# Altium schematic sheet Output.SchDoc: Outputs
size A4; Engineer: CT; SheetNumber: 4; SheetTotal: 5
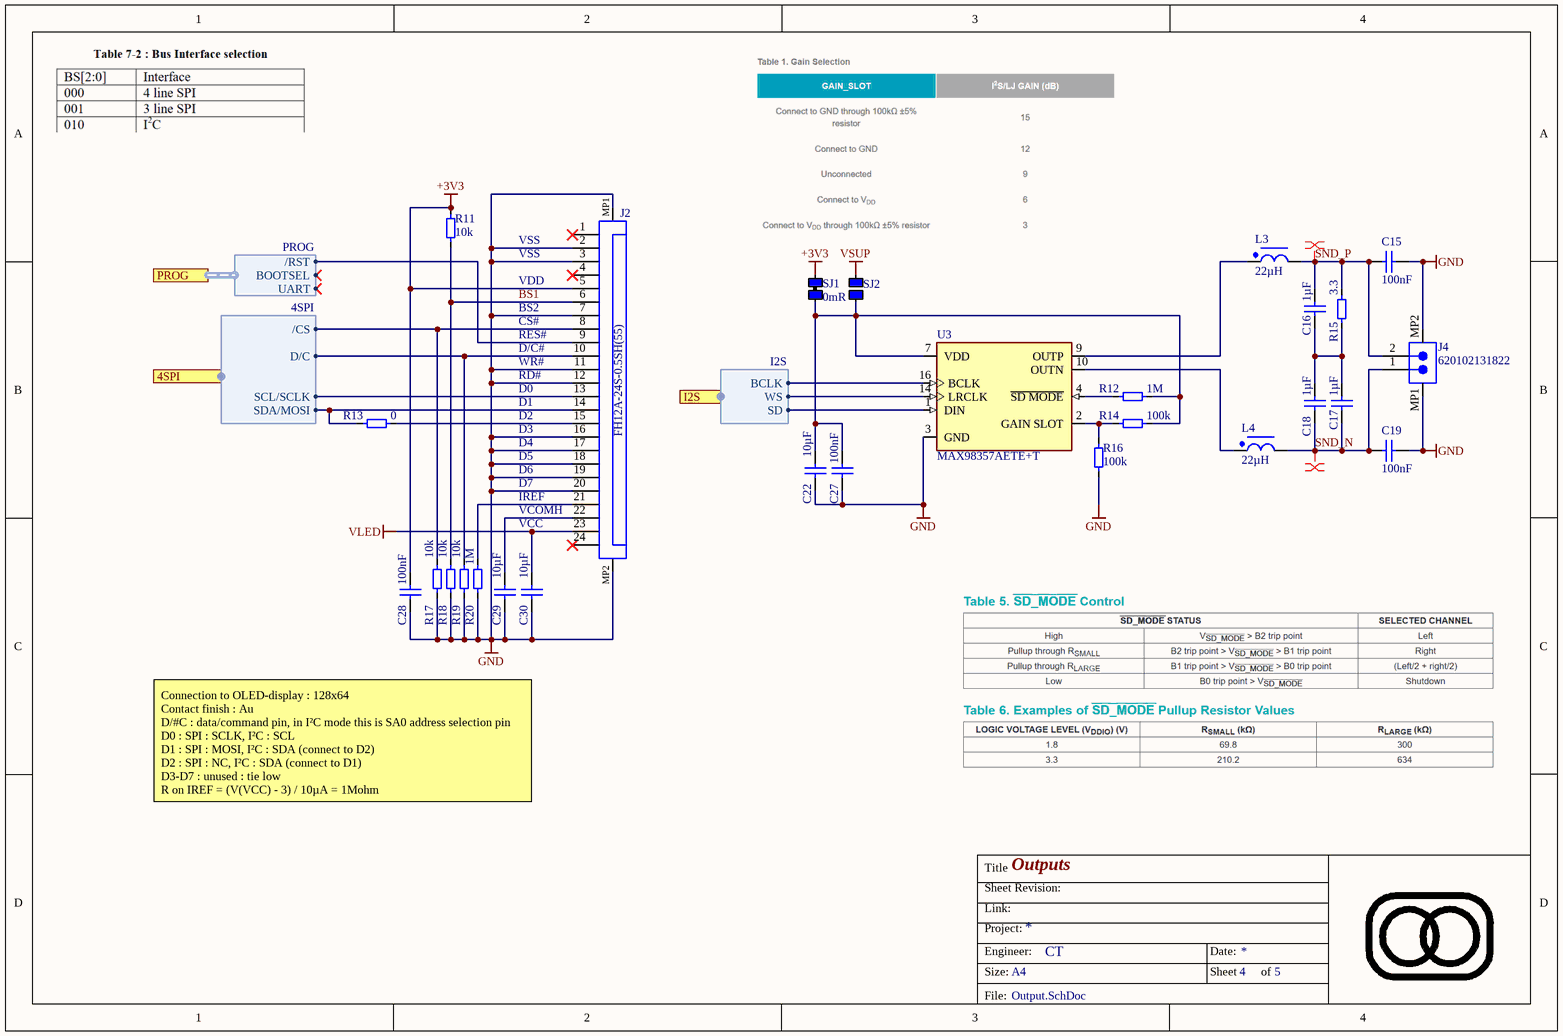
[diagram p0: Output.SchDoc]

## Parts
C15  value 100nF  [0603-C-N]  (hidden comment: Capacitor 100nF +/-10% 50V X7R 0603)
C16  value 1µF  [0805-C-N]  (hidden comment: Capacitor 1µF +/-10% 10V X7R 0805)
C17  value 1µF  [0805-C-N]  (hidden comment: Capacitor 1µF +/-10% 10V X7R 0805)
C18  value 1µF  [0805-C-N]  (hidden comment: Capacitor 1µF +/-10% 10V X7R 0805)
C19  value 100nF  [0603-C-N]  (hidden comment: Capacitor 100nF +/-10% 50V X7R 0603)
C22  value 10µF  [1206-C-N]  (hidden comment: Capacitor 10µF +/-10% 10V X7R 1206)
C27  value 100nF  [0603-C-N]  (hidden comment: Capacitor 100nF +/-10% 50V X7R 0603)
C28  value 100nF  [0603-C-N]  (hidden comment: Capacitor 100nF +/-10% 50V X7R 0603)
C29  value 10µF  [WCAP-CSGP_1210_L3.2W2.5H2.5]  (hidden comment: Capacitor 10µF +/-10% 50V X7R 1210)
C30  value 10µF  [1206-C-N]  (hidden comment: Capacitor 10µF +/-10% 10V X7R 1206)
J2  FH12A-24S-0.5SH(55)  [CF20241U0R0-NH]
J4  620102131822  [620102131822]
L3  Inductance: 22µH  [WE-LQS_6028]  (hidden comment: 74404063220)
L4  Inductance: 22µH  [WE-LQS_6028]  (hidden comment: 74404063220)
R11  value 10k  [0603-R-N]  (hidden comment: Resistor 10k +/-1% 50V 0603)
R12  value 1M  [0603-R-N]  (hidden comment: Resistor 1M +/-1% 50V 0603)
R13  value 0  [0603-R-N]  (hidden comment: Jumper 0R <50 mOhm 1A 0603)
R14  value 100k  [0603-R-N]  (hidden comment: Resistor 100k +/-1% 50V 0603)
R15  value 3.3  [1206-R-N]  (hidden comment: Resistor 3.3ohm 1% 0.25W 1206)
R16  value 100k  [0603-R-N]  (hidden comment: Resistor 100k +/-1% 50V 0603)
R17  value 10k  [0603-R-N]  (hidden comment: Resistor 10k +/-1% 50V 0603)
R18  value 10k  [0603-R-N]  (hidden comment: Resistor 10k +/-1% 50V 0603)
R19  value 10k  [0603-R-N]  (hidden comment: Resistor 10k +/-1% 50V 0603)
R20  value 1M  [0603-R-N]  (hidden comment: Resistor 1M +/-1% 50V 0603)
SJ1  value 0mR  [SJ_0603_1A]  (hidden comment: SJ-0603-1A)  (net tie, no BOM)
SJ2  Solder jumper open 1A  [Solder jumper open 1A-Footprint-1]  (value not drawn)  (no BOM)
U3  MAX98357AETE+T  [TQFN16-MFG]

## Ports
4SPI (harness 4SPI), I2S (harness I2S), PROG (harness PROG)

## Harnesses
4SPI: SDA/MOSI, SCL/SCLK, /CS, D/C
PROG: /RST, UART, BOOTSEL
I2S: BCLK, WS, SD

## Nets
+3V3: C28.1 J2.5 R11.2 SJ1.2(R)
GND: C15.2 C19.2 C22.1 C27.1 C28.2 C29.1 C30.1 J2.2 J2.3 J2.7 J2.11 J2.12 J2.16 J2.17 J2.18 J2.19 J2.20 J2.MP1 J2.MP2 J4.MP1 J4.MP2 R16.1 R17.1 R18.1 R19.1 R20.1 U3.3(GND)
VLED: C30.2 J2.23
VSUP: SJ2.2(R)
BS1: J2.6 R11.1 R18.2
SND_N: C17.1 C18.1 C19.1 J4.1 L4.2
SND_P: C15.1 C16.2 J4.2 L3.2 R15.2
NetC16_1: C16.1 C17.2 C18.2 R15.1
NetC22_2: C22.2 C27.2 R12.1 R14.2 SJ1.1(L) SJ2.1(L) U3.7(VDD)
NetC29_2: C29.2 J2.22
NetJ2_8: J2.8 R17.2 ; port 4SPI./CS
NetJ2_9: J2.9 ; port PROG./RST
NetJ2_10: J2.10 R19.2 ; port 4SPI.D/C
NetJ2_13: J2.13 ; port 4SPI.SCL/SCLK
NetJ2_14: J2.14 R13.2 ; port 4SPI.SDA/MOSI
NetJ2_15: J2.15 R13.1
NetJ2_21: J2.21 R20.2
NetL3_1: L3.1 U3.9(OUTP)
NetL4_1: L4.1 U3.10(OUTN)
NetR12_2: R12.2 U3.4(~{SD_MODE})
NetR14_1: R14.1 R16.2 U3.2(GAIN_SLOT)
NetU3_1: U3.1(DIN) ; port I2S.SD
NetU3_14: U3.14(LRCLK) ; port I2S.WS
NetU3_16: U3.16(BCLK) ; port I2S.BCLK

Not connected (* = marked no-connect by the designer): J2 1* 4* 24*

## Layout directives
differential pair: SND_N, SND_P

## Notes on the sheet
- VSS
- VDD
- BS2
- CS#
- WR#
- RD#
- RES#
- D/C#
- D0
- D1
- D2
- D3
- D4
- D5
- D6
- D7
- IREF
- VCOMH
- VCC
- Connection to OLED-display : 128x64
  Contact finish : Au
  D/#C : data/command pin, in I²C mode this is SA0 address selection pin
  D0 : SPI : SCLK, I²C : SCL
  D1 : SPI : MOSI, I²C : SDA (connect to D2)
  D2 : SPI : NC, I²C : SDA (connect to D1)
  D3-D7 : unused : tie low
  R on IREF = (V(VCC) - 3) / 10µA = 1Mohm
- Title
- Sheet Revision:
- Link:
- Size:
- Project:
- Engineer:
- A4
- Date:
- Sheet
- of
- File:

## Library data of the parts
C15 C19 C27 C28 = CMP-072-000619-13: WCAP-CSGP Multilayer Ceramic Chip Capacitor, General Purpose, size 0603, X7R, 100nF, 50VDC; Capacitor Type: MLCC; Tolerance: 10%; Dissipation Factor: 3%; Technical Reference: X7R0603104K050DFCT10000; Insulation Resistance: 5GO; Length: 1.6mm; Dielectric: X7R; Height: 0.8mm; Pins: 2; Min Operating Temperature: -55°C; Usage: General Purpose; Mounting Technology: SMT; Case/Package: 0603; Width: 0.8mm; Max Operating Temperature: 125°C; Voltage Rating: 50V; Design Item ID: 885012206095; ComponentLink1URL: https://www.we-online.com/redexpert/article/885012206095?ad; ComponentLink2URL: https://www.we-online.com/redexpert/spec/885012206095?ad; Packaging: Tape and Reel; ComponentLink1Description: Website Link; Match Code: WCAP-CSGP; ComponentLink2Description: Datasheet Link; Source: WCAP-CSGP.SchLib; JLCPCB Part #: C14663
C16-C18 = CMP-072-000659-13: WCAP-CSGP Multilayer Ceramic Chip Capacitor, General Purpose, size 0805, X7R, 1µF, 10VDC; Tolerance: 10%; Capacitor Type: MLCC; Technical Reference: X7R0805105K010DFCT10000; Dissipation Factor: 5%; Insulation Resistance: 0.5GO; Case/Package: 0805; Source: WCAP-CSGP.SchLib; Width: 1.25mm; Pins: 2; ComponentLink2Description: Datasheet Link; Packaging: Tape and Reel; Match Code: WCAP-CSGP; Voltage Rating: 10V; Dielectric: X7R; Min Operating Temperature: -55°C; Mounting Technology: SMT; Max Operating Temperature: 125°C; ComponentLink1URL: https://www.we-online.com/redexpert/article/885012207022?ad; JLCPCB Part #: C28323; Height: 1.25mm; Design Item ID: 885012207022; Usage: General Purpose; ComponentLink1Description: Website Link; ComponentLink2URL: https://www.we-online.com/redexpert/spec/885012207022?ad; Length: 2mm
C22 = CMP-072-000777-12: WCAP-CSGP Multilayer Ceramic Chip Capacitor, General Purpose, size 1206, X7R, 10µF, 10VDC; Dissipation Factor: 10%; Insulation Resistance: 0.01GO; Capacitor Type: MLCC; Technical Reference: X7R1206106K010DFCT10000; Width: 1.6mm; Source: WCAP-CSGP.SchLib; ComponentLink2URL: https://www.we-online.com/redexpert/spec/885012208018?ad; Tolerance: 10%; Packaging: Tape and Reel; Voltage Rating: 10V; ComponentLink2Description: Datasheet Link; Usage: General Purpose; Design Item ID: 885012208018; Pins: 2; Max Operating Temperature: 125°C; Height: 1.6mm; ComponentLink1URL: https://www.we-online.com/redexpert/article/885012208018?ad; Dielectric: X7R; Case/Package: 1206; ComponentLink1Description: Website Link; Min Operating Temperature: -55°C; Length: 3.2mm; Match Code: WCAP-CSGP; Mounting Technology: SMT; JLCPCB Part #: C97953
C29 = CMP-072-000922-13: WCAP-CSGP Multilayer Ceramic Chip Capacitor, General Purpose, size 1210, X7R, 10µF, 50VDC; Capacitor Type: MLCC; Dissipation Factor: 10%; Technical Reference: X7R1210106K050DFCT10000; Insulation Resistance: 0.01GO; Dielectric: X7R; ComponentLink2Description: Datasheet Link; Length: 3.2mm; Height: 2.5mm; Width: 2.5mm; Match Code: WCAP-CSGP; Usage: General Purpose; Case/Package: 1210; ComponentLink1Description: Website Link; JLCPCB Part #: C2918502; Source: WCAP-CSGP.SchLib; ComponentLink2URL: https://www.we-online.com/redexpert/spec/885012209073?ad; Min Operating Temperature: -55°C; Voltage Rating: 50V; Max Operating Temperature: 125°C; Tolerance: 10%; Design Item ID: 885012209073; Mounting Technology: SMT; Pins: 2; Packaging: Tape and Reel; ComponentLink1URL: https://www.we-online.com/redexpert/article/885012209073?ad
C30 = CMP-072-000777-12: WCAP-CSGP Multilayer Ceramic Chip Capacitor, General Purpose, size 1206, X7R, 10µF, 10VDC; Capacitor Type: MLCC; Dissipation Factor: 10%; Technical Reference: X7R1206106K010DFCT10000; Insulation Resistance: 0.01GO; Dielectric: X7R; ComponentLink2Description: Datasheet Link; Length: 3.2mm; Height: 1.6mm; Width: 1.6mm; Match Code: WCAP-CSGP; Usage: General Purpose; Case/Package: 1206; ComponentLink1Description: Website Link; Source: WCAP-CSGP.SchLib; ComponentLink2URL: https://www.we-online.com/redexpert/spec/885012208018?ad; Min Operating Temperature: -55°C; Voltage Rating: 10V; Max Operating Temperature: 125°C; Tolerance: 10%; Design Item ID: 885012208018; Mounting Technology: SMT; Pins: 2; Packaging: Tape and Reel; ComponentLink1URL: https://www.we-online.com/redexpert/article/885012208018?ad; JLCPCB Part #: C97953
J2 = CMP-043-000245-3: Conn Ffc/fpc Connector Skt 24 Pos 0.5MM Solder Ra SMD T/r / Conn Ffc Top 24POS 0.50MM R/a; Actuator Material: Polyphenylene; Number of Positions: 24; Voltage Rating: 50V; Insulation Resistance: 500MR; Current Rating: 500mA; JLCPCB Part #: C506794; Flammability Rating: UL94 V-0; Contact Location: Top; Min Operating Temperature: -40°C; Package Quantity: 2000; Termination: Solder; Contact Material: Bronze; RoHS Compliant: Yes; Contact Plating: Gold; Pins: 24; Mounting Technology: Surface Mount; Pitch: 0.5mm; Packaging: Tape and Reel; Series: FH12; Max Operating Temperature: 70°C; Orientation: Right Angle; Housing Material: Polyamide
J4 = CMP-047-000040-11: WR-WTB SMT Male Horizontal Shrouded Header, pitch 2mm, 2p; Pin Number: 2; Working Voltage: 100VAC; Withstanding Voltage: 800VAC; Rated Current: 2A; Contact Resistance: 20mOhm; Pitch: 2mm; Operating Temperature: -25 to +85degC; ComponentLink1Description: Manufacturer; ComponentLink1URL: http://www.we-online.de; Gender: Male; Packaging: Tape and Reel; Pin Count: 2; Component Type: Standard; Mounting Technology: SMT; Type: Horizontal; Part Number: 620102131822; ComponentLink2Description: Datasheet; Publisher: Wurth Elektronik; Source: WR-WTB_2.00mm.SchLib; Design Item ID: 620102131822; Published Date: January 2020; JLCPCB Part #: C295747; ComponentLink2URL: https://www.we-online.com/catalog/datasheet/620102131822.pdf
L3 L4 = CMP-002-001259-2: WE-LQS SMT Power Inductor, size 6028, 22µH, 1.4A, 0.14O; Manufacturer: Wurth Elektronik; Case/Size Code: 6028; Saturation Current: 1.6A; Self Resonant Frequency: 21MHz; DC Resistance: 0.14O; Match Code: WE-LQS; Rated Current: 1.4A; ComponentLink2Description: Datasheet Link; Category: Shielded Power Inductors; Manufacturer Part Number: 74404063220; Component Type: Standard; Pin Count: 2; JLCPCB Part #: C668454; Height: 2.8mm; Source: WE-LQS.SchLib; ComponentLink2URL: https://www.we-online.com/redexpert/spec/74404063220?ad; ComponentLink1URL: https://www.we-online.com/redexpert/article/74404063220?ad; ComponentLink1Description: Website Link; Design Item ID: 74404063220; Packaging: Tape and Reel; Width: 6mm; Operating Temperature Min: -40°C; Mount: Surface Mount; Length: 6mm; Operating Temperature Max: 125°C
R11 R17-R19 = CMP-009-00017-23: Chip Resistor, Thick Film, General Purpose, 0603, 100mW, 50V, 10 kOhm, +/-1%; Tolerance: 1%; Elements: 1; Power Rating: 100mW; RoHS Compliant: True; Voltage Rating: 50V; Mounting Technology: SMT; Usage: General Purpose; JLCPCB Part #: C25804; Max Operating Temperature: 155°C; Case/Package: 0603; Pins: 2; Resistor Type: Thick Film; Min Operating Temperature: -55°C
R12 R20 = CMP-009-00234-14: Chip Resistor, Thick Film, General Purpose, 0603, 100mW, 50V, 1 MOhm, +/-1%; Elements: 1; Tolerance: 1%; Voltage Rating: 50V; Max Operating Temperature: 155°C; Mounting Technology: SMT; Resistor Type: Thick Film; RoHS Compliant: Yes; Power Rating: 100mW; Usage: General Purpose; Pins: 2; Min Operating Temperature: -55°C; JLCPCB Part #: C22935; Case/Package: 0603
R13 = CMP-009-00006-22: Chip Jumper, Thick Film, Jumper, 0603, 100mW, 1A, 0 Ohm, <50 mOhm; Tolerance: 50 mOhm; Elements: 1; Voltage Rating: 75V; Mounting Technology: SMT; Usage: Jumper; Max Operating Temperature: 155°C; Pins: 2; Case/Package: 0603; JLCPCB Part #: C21189; Current Rating: 1A; Power Rating: 100mW; RoHS Compliant: True; Min Operating Temperature: -55°C; Resistor Type: Thick Film
R14 R16 = CMP-009-00023-24: Chip Resistor, Thick Film, General Purpose, 0603, 100mW, 50V, 100 kOhm, +/-1%; Elements: 1; Tolerance: 1%; Usage: General Purpose; Mounting Technology: SMT; Power Rating: 100mW; Case/Package: 0603; Voltage Rating: 50V; Max Operating Temperature: 155°C; Resistor Type: Thick Film; RoHS Compliant: True; Pins: 2; Min Operating Temperature: -55°C; JLCPCB Part #: C25803
R15 = CMP-009-00346-2: Res Thick Film 1206 3.3 Ohm 1% 1/4W ±200ppm/°C Molded SMD SMD Paper T/R; Max Power Dissipation: 250mW; Min Operating Temperature: -55°C; Mounting Technology: Surface Mount; Height: 0.028inch; Features: Automotive AEC-Q200; Width: 0.063inch; JLCPCB Part #: C17945; Case Code (Metric): 3216; Tolerance: 1%; Contact Plating: Tin,Matte; Case/Package: 1206; Series: RMCF; Radiation Hardening: No; Max Operating Temperature: 155°C; Packaging: Tape and Reel; Number of Terminations: 2; Temperature Coefficient: 200ppm/°C; RoHS Compliant: Yes; Case Code (Imperial): 1206; Length: 0.126inch
SJ1 = CMP-009-00345-3: Solder jumper 0603 1A; Voltage Rating: 50V; Max Power Dissipation: 100mW; Tolerance: 1%; Temperature Coefficient: 200ppm/°C; Resistance Tolerance: 5%; Voltage Rating (AC): 200V; Package Quantity: 5000; Pins: 2; Packaging: Tape and Reel; Case/Package: 0603; Number of Terminations: 2; Series: RC; Construction: Rectangular; Reach SVHC Compliant: Unknown; Military Standard: Not; Depth: 0.8mm; JLCPCB Part #: C876125; Case Code (Metric): 1608; Lead Free: Lead Free; RoHS Compliant: Yes; Power Rating: 100mW; Height: 0.45mm; Resistor Type: Thick Film; Min Operating Temperature: -55°C; Length: 1.6mm; Technology: THICK FILM; Voltage Rating (DC): 50V; Contact Plating: Tin,Matte; Case Code (Imperial): 0603; Max Operating Temperature: 155°C; Width: 0.8mm; Features: Moisture Resistant; Termination: SMD/SMT
SJ2 = CMP-00004-3
U3 = CMP-014-00012-1: IC AUDIO AMP CLASS D 16-TQFN; pin to pad: 3>3+11+15+17 7>7+8; Power Supply Rejection Ratio (PSRR): 77dB; Voltage Gain: 15dB; Max Output Power: 3.2W; Min Supply Voltage: 2.5V; Max Supply Voltage: 5.5V; RoHS Compliant: Yes; Mounting Technology: Surface Mount; Radiation Hardening: No; Series: -; Max Operating Temperature: 85°C; Min Operating Temperature: -40°C; Pins: 16; Packaging: Tape and Reel; JLCPCB Part #: C910544